# EAGLE design Naze32 (EAGLE 7.1.0)
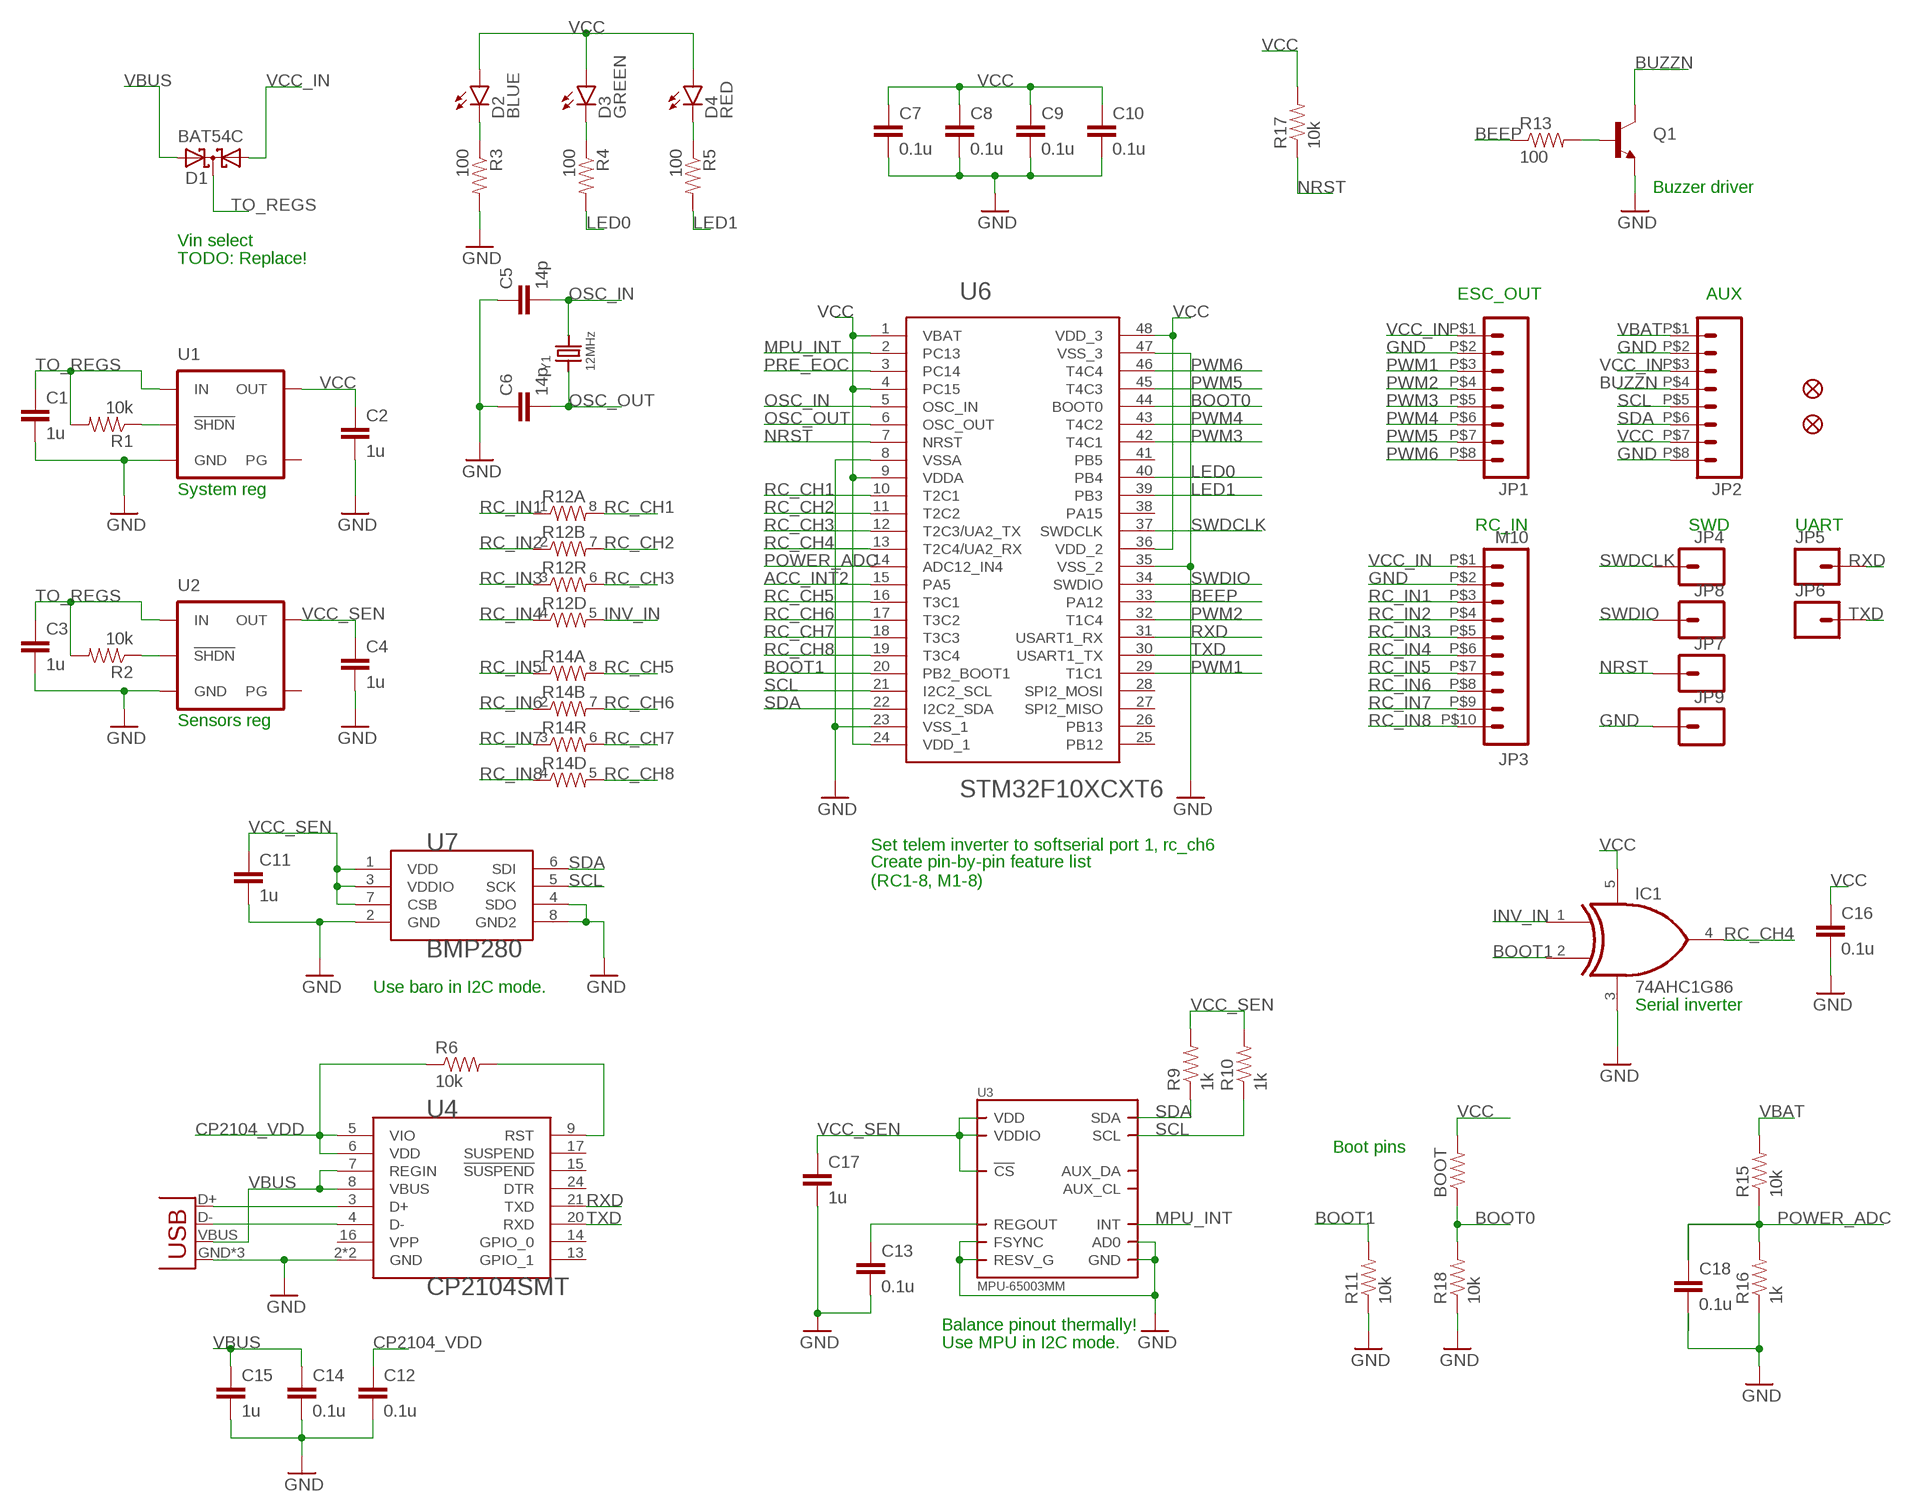
[diagram p0: schematic, sheet 1]

## Parts
BOOT  RESISTOR0603  [0603-RES]
C1  1u  CAP0402-CAP  [0402-CAP]
C2  1u  CAP0402-CAP  [0402-CAP]
C3  1u  CAP0402-CAP  [0402-CAP]
C4  1u  CAP0402-CAP  [0402-CAP]
C5  14p  CAP0402-CAP  [0402-CAP]
C6  14p  CAP0402-CAP  [0402-CAP]
C7  0.1u  CAP0402-CAP  [0402-CAP]
C8  0.1u  CAP0402-CAP  [0402-CAP]
C9  0.1u  CAP0402-CAP  [0402-CAP]
C10  0.1u  CAP0402-CAP  [0402-CAP]
C11  1u  CAP0402-CAP  [0402-CAP]
C12  0.1u  CAP0402-CAP  [0402-CAP]
C13  0.1u  CAP0402-CAP  [0402-CAP]
C14  0.1u  CAP0402-CAP  [0402-CAP]
C15  1u  CAP0402-CAP  [0402-CAP]
C16  0.1u  CAP0402-CAP  [0402-CAP]
C17  1u  CAP0402-CAP  [0402-CAP]
C18  0.1u  CAP0402-CAP  [0402-CAP]
D1  BAT54C  [SOT23]
D2  BLUE  LED-BLUE0603  [LED-0603]
D3  GREEN  LED-GREEN0603  [LED-0603]
D4  RED  LED-RED0603  [LED-0603]
FID1  FIDUCIALUFIDUCIAL  [MICRO-FIDUCIAL]
FID2  FIDUCIALUFIDUCIAL  [MICRO-FIDUCIAL]
IC1  74AHC1G86  74AHC1G86DCK  [SC70-5]
J1  USB-MICROB  [USB-MICROB]
JP1  M08PAD-1X8  [PAD-1X8]
JP2  M08PAD-1X8  [PAD-1X8]
JP3  M10  [PAD_1X10]
JP4  SCK  M01ROUND  [PAD-ROUND]
JP5  RX  M01ROUND  [PAD-ROUND]
JP6  TX  M01ROUND  [PAD-ROUND]
JP7  RST  M01ROUND  [PAD-ROUND]
JP8  IO  M01ROUND  [PAD-ROUND]
JP9  GND  M01ROUND  [PAD-ROUND]
Q1  TRANSISTOR_NPNSOT23  [SOT23]
R1  10k  RESISTOR  [0402-RES]
R2  10k  RESISTOR  [0402-RES]
R3  100  RESISTOR  [0402-RES]
R4  100  RESISTOR  [0402-RES]
R5  100  RESISTOR  [0402-RES]
R6  10k  RESISTOR  [0402-RES]
R9  1k  RESISTOR  [0402-RES]
R10  1k  RESISTOR  [0402-RES]
R11  10k  RESISTOR  [0402-RES]
R12  RESISTOR-ARRAY0603-ARV  [0603-ARV]
R13  100  RESISTOR  [0402-RES]
R14  RESISTOR-ARRAY0603-ARV  [0603-ARV]
R15  10k  RESISTOR  [0402-RES]
R16  1k  RESISTOR  [0402-RES]
R17  10k  RESISTOR  [0402-RES]
R18  10k  RESISTOR  [0402-RES]
U1  MCP18243.3V  [SOT23-5]
U2  MCP18243.3V  [SOT23-5]
U3  MPU-65003MM  [QFN-24_3X3]
U4  CP2104SMT  [QFN-24_ALT2]
U6  STM32F10XCXT6  [TQFP48]
U7  BMP280  [LGA8]
Y1  12MHz  CRYSTAL.3.2X2.5MM  [3.2X2.5MM]

## Nets
ACC_INT2: U6.15(PA5)
BEEP: R13.1 U6.33(PA12)
BOOT0: BOOT.1 R18.2 U6.44(BOOT0)
BOOT1: IC1.2(I1) R11.2 U6.20(PB2_BOOT1)
BUZZN: JP2.P$4 Q1.3(C)
CP2104_VDD: C12.1 R6.1 U4.5(VIO) U4.6(VDD)
GND: C1.2 C2.2 C3.2 C4.2 C5.1 C6.1 C7.2 C8.2 C9.2 C10.2 C11.2 C12.2 C13.2 C14.2 C15.2 C16.2 C17.2 C18.2 IC1.3(GND) J1.GND J1.MT1(GND) J1.MT2(GND) JP1.P$2 JP2.P$2 JP2.P$8 JP3.P$2 JP9.P$1 Q1.2(E) R3.2 R11.1 R16.1 R18.1 U1.2(GND) U2.2(GND) U3.9(AD0) U3.11(FSYNC) U3.18(GND) U3.20(RESV_G) U4.2(GND) U4.EP(GND) U6.8(VSSA) U6.23(VSS_1) U6.35(VSS_2) U6.47(VSS_3) U7.2(GND) U7.4(SDO) U7.8(GND2)
INV_IN: IC1.1(I0) R12.5
LED0: R4.2 U6.40(PB4)
LED1: R5.2 U6.39(PB3)
MPU_INT: U3.12(INT) U6.2(PC13)
N$1: J1.D+ U4.3(D+)
N$2: R2.1 U2.3(!SHDN)
N$3: R1.1 U1.3(!SHDN)
N$4: D2.C R3.1
N$5: J1.D- U4.4(D-)
N$7: D3.C R4.1
N$8: D4.C R5.1
N$9: R6.2 U4.9(RST)
N$15: C13.1 U3.10(REGOUT)
N$17: Q1.1(B) R13.2
NRST: JP7.P$1 R17.1 U6.7(NRST)
OSC_IN: C5.2 U6.5(OSC_IN) Y1.3
OSC_OUT: C6.2 U6.6(OSC_OUT) Y1.1
POWER_ADC: C18.1 R15.1 R16.2 U6.14(ADC12_IN4)
PRE_EOC: U6.3(PC14)
PWM1: JP1.P$3 U6.29(T1C1)
PWM2: JP1.P$4 U6.32(T1C4)
PWM3: JP1.P$5 U6.42(T4C1)
PWM4: JP1.P$6 U6.43(T4C2)
PWM5: JP1.P$7 U6.45(T4C3)
PWM6: JP1.P$8 U6.46(T4C4)
RC_CH1: R12.8 U6.10(T2C1)
RC_CH2: R12.7 U6.11(T2C2)
RC_CH3: R12.6 U6.12(T2C3/UA2_TX)
RC_CH4: IC1.4(O) U6.13(T2C4/UA2_RX)
RC_CH5: R14.8 U6.16(T3C1)
RC_CH6: R14.7 U6.17(T3C2)
RC_CH7: R14.6 U6.18(T3C3)
RC_CH8: R14.5 U6.19(T3C4)
RC_IN1: JP3.P$3 R12.1
RC_IN2: JP3.P$4 R12.2
RC_IN3: JP3.P$5 R12.3
RC_IN4: JP3.P$6 R12.4
RC_IN5: JP3.P$7 R14.1
RC_IN6: JP3.P$8 R14.2
RC_IN7: JP3.P$9 R14.3
RC_IN8: JP3.P$10 R14.4
RXD: JP5.P$1 U4.21(TXD) U6.31(USART1_RX)
SCL: JP2.P$5 R10.1 U3.23(SCL) U6.21(I2C2_SCL) U7.5(SCK)
SDA: JP2.P$6 R9.1 U3.24(SDA) U6.22(I2C2_SDA) U7.6(SDI)
SWDCLK: JP4.P$1 U6.37(SWDCLK)
SWDIO: JP8.P$1 U6.34(SWDIO)
TO_REGS: C1.1 C3.1 D1.3(CC) R1.2 R2.2 U1.1(IN) U2.1(IN)
TXD: JP6.P$1 U4.20(RXD) U6.30(USART1_TX)
VBAT: JP2.P$1 R15.2
VBUS: C14.1 C15.1 D1.2(A2) J1.VBUS U4.7(REGIN) U4.8(VBUS)
VCC: BOOT.2 C2.1 C7.1 C8.1 C9.1 C10.1 C16.1 D2.A D3.A D4.A IC1.5(VCC) JP2.P$7 R17.2 U1.5(OUT) U6.1(VBAT) U6.4(PC15) U6.9(VDDA) U6.24(VDD_1) U6.36(VDD_2) U6.48(VDD_3)
VCC_IN: D1.1(A1) JP1.P$1 JP2.P$3 JP3.P$1
VCC_SEN: C4.1 C11.1 C17.1 R9.2 R10.2 U2.5(OUT) U3.8(VDDIO) U3.13(VDD) U3.22(!CS) U7.1(VDD) U7.3(VDDIO) U7.7(CSB)
Unconnected: U1.4(PG) U2.4(PG) U3.7(AUX_CL) U3.21(AUX_DA) U4.13(GPIO_1) U4.14(GPIO_0) U4.15(!SUSPEND) U4.16(VPP) U4.17(SUSPEND) U4.24(DTR) U6.25(PB12) U6.26(PB13) U6.27(SPI2_MISO) U6.28(SPI2_MOSI) U6.38(PA15) U6.41(PB5)

## Notes on the sheet
- Buzzer driver
- Vin select
- TODO: Replace!
- ESC_OUT | AUX
- System reg
- RC_IN | SWD | UART
- Sensors reg
- Set telem inverter to softserial port 1, rc_ch6
- Create pin-by-pin feature list
  (RC1-8, M1-8)
- Use baro in I2C mode.
- Serial inverter
- Boot pins
- Balance pinout thermally!
- Use MPU in I2C mode.

## Library data of the parts
BOOT R1-R6 R9-R11 R13 R15-R18 = Naze32Lib:RESISTOR: Resistor Basic schematic elements and footprints for 0603, 1206, and PTH resistors.
C1-C18 = Naze32Lib:CAP: Capacitor Standard 0603 ceramic capacitor, and 0.1" leaded capacitor.
D1 = Naze32Lib:BAT54C: Schottky Diodes Source: Fairchild .. BAT54.pdf
D2 = Naze32Lib:LED-BLUE: Blue LEDs for production use Various blue LEDs stocked by SparkFun production 0603 - DIO-08575 Rebel - DIO-09553 1206 - DIO-09911; PROD_ID: DIO-08575
D3 = Naze32Lib:LED-GREEN: Various green LEDs Green LEDs used in SFE Production 0603- DIO-00821 LARGE- DIO-00862 LILYPAD- DIO-09910; PROD_ID: DIO-00821
D4 = Naze32Lib:LED-RED: Assorted Red LEDs LilyPad 1206- DIO-09912 1206- DIO-00809 0603- DIO-00819; PROD_ID: DIO-00819
FID1 FID2 = Naze32Lib:FIDUCIAL: Fiducial Alignment Points Various fiducial points for machine vision alignment.
IC1 = Naze32Lib:74*1G86: 2-input EXCLUSIV-OR gate
J1 = Naze32Lib:USB: USB Connectors USB-B-PTH is fully proven SKU : PRT-00139/CONN-08278 USB-miniB is fully proven SKU : PRT-00587 USB-A-PCB is untested. USB-A-H is throughly reviewed, but untested. Spark Fun Electronics SKU : PRT-00437 USB-B-SMT is throughly reviewed, but untested. Needs silkscreen touching up. USB-A-S has not been used/tested USB-MB-H has not been used/tested USB-MICROB has been used. CONN-09505; PROD_ID: CONN-09505
JP1 JP2 = Naze32Lib:M08: Header 8 Standard 8-pin 0.1" header. Use with straight break away headers (SKU : PRT-00116), right angle break away headers (PRT-00553), swiss pins (PRT-00743), machine pins (PRT-00117), and female headers (PRT-00115).
JP3 = Naze32Lib:M10: Header 10 Standard 10-pin 0.1" header. Use with straight break away headers (SKU : PRT-00116), right angle break away headers (PRT-00553), swiss pins (PRT-00743), machine pins (PRT-00117), and female headers (PRT-00115).
JP4-JP9 = Naze32Lib:M01: Header 1 Standard 1-pin 0.1" header. Use with straight break away headers (SKU : PRT-00116), right angle break away headers (PRT-00553), swiss pins (PRT-00743), machine pins (PRT-00117), and female headers (PRT-00115).
Q1 = Naze32Lib:TRANSISTOR_NPN: Generic NPN BJT MMBT2222A - TRANS-08049 (SOT-23, 1A 40V) MPSA42 - TRANS-09116 (SOT-23, 500mA 300V) MMBT5088LT1G - TRANS-11160 (SOT-23, 50 mA 30V) BC547 - COM-08928 <http://www.sparkfun.com/products/8928> (TO-92 45V 100mA) (1.Collector 2.Base 3.Emitter) 2N3904 - COM-00521 <http://www.sparkfun.com/products/521> (TO-92 40V 200mA) (1.Emitter 2.Base 3.Collector) P2N2222A - COM-12852 <http://www.sparkfun.com/products/12852> (TO-92 40V 600mA) (1.Collector 2.Base 3.Emitter)
R12 R14 = Naze32Lib:RESISTOR-ARRAY: Array Chip Resistor Source: RS Component / Phycomp
U1 U2 = Naze32Lib:MCP1824: MIC5205 150mA vreg 3.3V - VREG-00822 5V - VREG-00823; PROD_ID: VREG-00822
U3 = Naze32Lib:MPU-6500
U4 = Naze32Lib:CP2104
U6 = Naze32Lib:STM32F10XCXT6: ST STM32F101/103 48pin LQFP
U7 = Naze32Lib:BMP280
Y1 = Naze32Lib:CRYSTAL

## Board
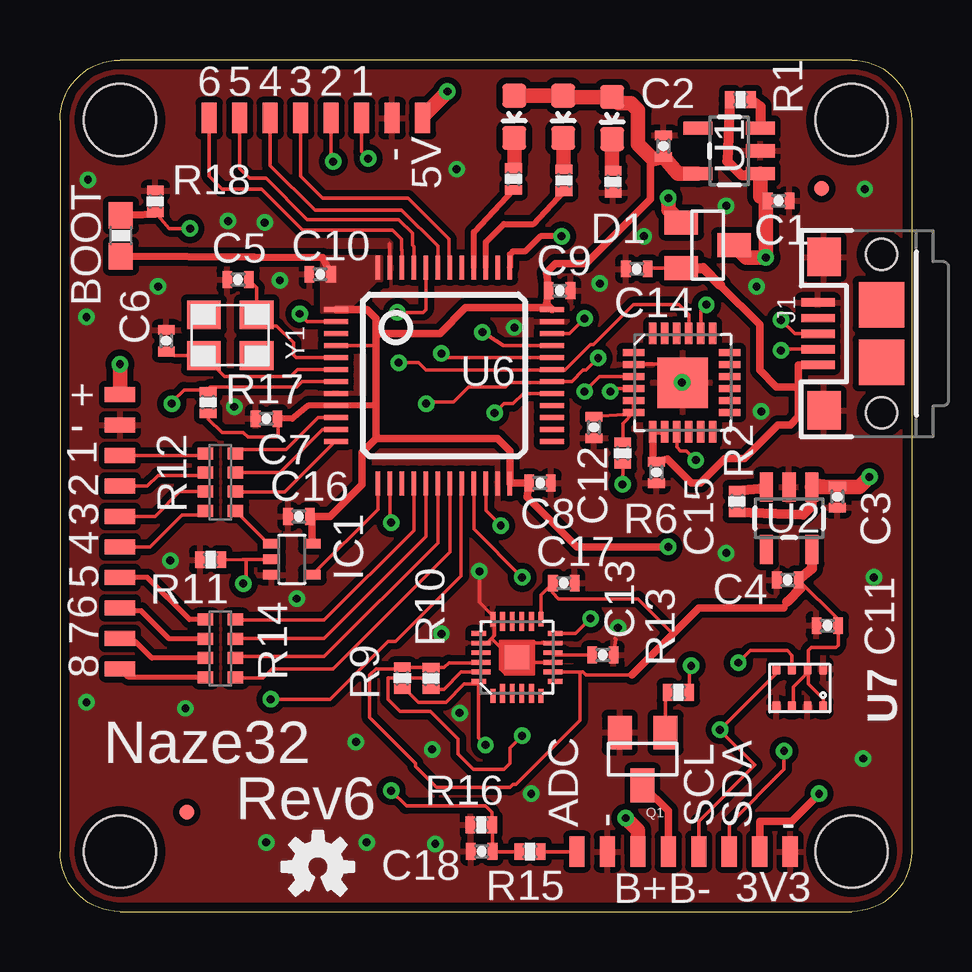
[diagram p1: board, top side]
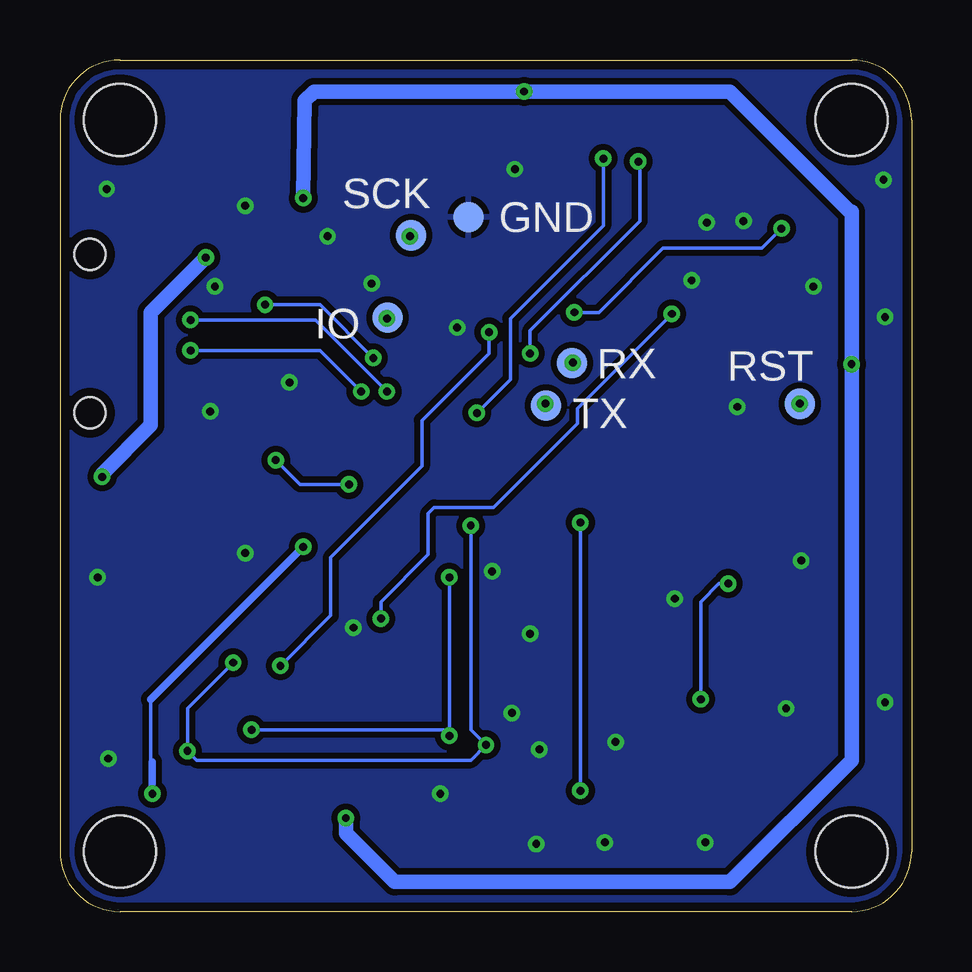
[diagram p2: board, bottom side, seen from below]

Size 35.5 x 35.5 mm. Coordinates in mm from the lower left corner, seen from the top.
Outline: 2.5,0 33,0 arc90 35.5,2.5 35.5,33 arc90 33,35.5 2.5,35.5 arc90 0,33 0,2.5 arc90 2.5,0
Copper layers (1*16): Top 0.0356mm / dielectric 1.5011mm / Bottom 0.0356mm
Design rules "OSHPark": minimum track width 6mil, minimum drill 13mil, track to track 6mil, track to pad 6mil, pad to pad 6mil, via to via 6mil, smd to smd 6mil, copper to edge 15mil, drill to drill 6mil, minimum pad ring 7mil, minimum via ring 7mil, stop-mask expansion 3mil, vias tented up to drill 0mil, thermal gap 10mil
Holes 3 mm at 2.5,2.5 33,2.5 33,33 2.5,33

### Footprints (pad centres in the part's own frame; a part is rotated, then mirrored left to right if it is on the bottom)
0603-RES = smd 1.1 x 1: 1 -0.85,0; 2 0.85,0
0402-CAP = smd 0.4 x 0.7: 1 -0.45,0; 2 0.45,0
SOT23 = smd 1 x 1.4: 1 -0.95,-1.1; 2 0.95,-1.1; 3 0,1.1
LED-0603 = smd 1 x 1: A 0,-0.877; C 0,0.877
MICRO-FIDUCIAL = smd 0.635 x 0.635: 1 0,0
SC70-5 = smd 0.4 x 0.7: 1 -0.65,-0.85; 2 0,-0.85; 3 0.65,-0.85; 4 0.65,0.85; 5 -0.65,0.85
USB-MICROB = smd 0.35 x 1.4: D+ 0,2.65; D- -0.65,2.65; GND 1.3,2.65; ID 0.65,2.65; VBUS -1.3,2.65 | smd 1.6 x 1.4: MT1 -3.2,2.4; MT2 3.2,2.4 | smd 1.9 x 1.9: P$1 -1.2,0; P$2 1.2,0 | hole 1.3: -3.3,0; 3.3,0
PAD-1X8 = smd 1.27 x 0.635: P$1 0,0; P$2 0,-1.27; P$3 0,-2.54; P$4 0,-3.81; P$5 0,-5.08; P$6 0,-6.35; P$7 0,-7.62; P$8 0,-8.89
PAD_1X10 = smd 1.27 x 0.635: P$1 0,0; P$2 0,-1.27; P$3 0,-2.54; P$4 0,-3.81; P$5 0,-5.08; P$6 0,-6.35; P$7 0,-7.62; P$8 0,-8.89; P$9 0,-10.16; P$10 0,-11.43
PAD-ROUND = smd 1.27 x 1.27: P$1 0,0
0402-RES = smd 0.4 x 0.7: 1 -0.45,0; 2 0.45,0
0603-ARV = smd 0.5 x 0.65: 1 -1.2,-0.625; 2 -0.4,-0.625; 3 0.4,-0.625; 4 1.2,-0.625; 5 1.2,0.625; 6 0.4,0.625; 7 -0.4,0.625; 8 -1.2,0.625
SOT23-5 = smd 0.55 x 1.2: 1 -0.95,-1.3; 2 0,-1.3; 3 0.95,-1.3; 4 0.95,1.3; 5 -0.95,1.3
QFN-24_3X3 = smd 0.6 x 0.2: 1 -1.6,1; 6 -1.6,-1; 13 1.6,-1; 18 1.6,1 | smd 0.8 x 0.2: 2 -1.5,0.6; 3 -1.5,0.2; 4 -1.5,-0.2; 5 -1.5,-0.6; 14 1.5,-0.6; 15 1.5,-0.2; 16 1.5,0.2; 17 1.5,0.6 | smd 0.2 x 0.6: 7 -1,-1.6; 12 1,-1.6; 19 1,1.6; 24 -1,1.6 | smd 0.2 x 0.8: 8 -0.6,-1.5; 9 -0.2,-1.5; 10 0.2,-1.5; 11 0.6,-1.5; 20 0.6,1.5; 21 0.2,1.5; 22 -0.2,1.5; 23 -0.6,1.5 | smd 1 x 1: EP 0,0
QFN-24_ALT2 = smd 0.9 x 0.3: 1 -2.05,1.25; 2 -2.05,0.75; 3 -2.05,0.25; 4 -2.05,-0.25; 5 -2.05,-0.75; 6 -2.05,-1.25; 13 1.95,-1.25; 14 1.95,-0.75; 15 1.95,-0.25; 16 1.95,0.25; 17 1.95,0.75; 18 1.95,1.25 | smd 0.3 x 0.9: 7 -1.25,-2.05; 8 -0.75,-2.05; 9 -0.25,-2.05; 10 0.25,-2.05; 11 0.75,-2.05; 12 1.25,-2.05; 19 1.25,2.05; 20 0.75,2.05; 21 0.25,2.05; 22 -0.25,2.05; 23 -0.75,2.05; 24 -1.25,2.05 | smd 2.1 x 2.1: EP 0,0
TQFP48 = smd 0.2 x 1: 1 -2.75,-4.5; 2 -2.25,-4.5; 3 -1.75,-4.5; 4 -1.25,-4.5; 5 -0.75,-4.5; 6 -0.25,-4.5; 7 0.25,-4.5; 8 0.75,-4.5; 9 1.25,-4.5; 10 1.75,-4.5; 11 2.25,-4.5; 12 2.75,-4.5; 25 2.75,4.5; 26 2.25,4.5; 27 1.75,4.5; 28 1.25,4.5; 29 0.75,4.5; 30 0.25,4.5; 31 -0.25,4.5; 32 -0.75,4.5; 33 -1.25,4.5; 34 -1.75,4.5; 35 -2.25,4.5; 36 -2.75,4.5 | smd 1 x 0.2: 13 4.5,-2.75; 14 4.5,-2.25; 15 4.5,-1.75; 16 4.5,-1.25; 17 4.5,-0.75; 18 4.5,-0.25; 19 4.5,0.25; 20 4.5,0.75; 21 4.5,1.25; 22 4.5,1.75; 23 4.5,2.25; 24 4.5,2.75; 37 -4.5,2.75; 38 -4.5,2.25; 39 -4.5,1.75; 40 -4.5,1.25; 41 -4.5,0.75; 42 -4.5,0.25; 43 -4.5,-0.25; 44 -4.5,-0.75; 45 -4.5,-1.25; 46 -4.5,-1.75; 47 -4.5,-2.25; 48 -4.5,-2.75
LGA8 = smd 0.5 x 0.35: 1 0.8,0.975; 2 0.8,0.325; 3 0.8,-0.325; 4 0.8,-0.975; 5 -0.8,-0.975; 6 -0.8,-0.325; 7 -0.8,0.325; 8 -0.8,0.975
3.2X2.5MM = smd 1.4 x 1.2: 1 -1.1,-0.85; 2 1.1,-0.85; 3 1.1,0.85; 4 -1.1,0.85

### Placement (x,y rotation side)
BOOT  2.54,28.17 270 top
C1  29.96,29.63 0 top
C2  25.16,31.91 90 top
C3  32.41,17.29 270 top
C4  30.34,13.83 180 top
C5  7.42,26.35 0 top
C6  4.44,23.79 270 top
C7  8.61,20.54 180 top
C8  20.02,17.87 0 top
C9  20.83,25.88 0 top
C10  10.85,26.56 180 top
C11  31.99,11.92 180 top
C12  22.26,20.18 270 top
C13  22.63,10.7 0 top
C14  24.05,26.79 180 top
C15  24.86,18.31 270 top
C16  9.96,16.47 180 top
C17  21,13.69 0 top
C18  17.58,2.51 180 top
D1  27,27.78 270 top
D2  23.02,33.08 180 top
D3  18.94,33.13 180 top
D4  20.98,33.13 180 top
FID1  5.29,4.14 0 top
FID2  31.75,30.14 0 top
IC1  9.67,14.69 270 top
J1  34.25,24.09 90 top
JP1  15.11,33.08 270 top
JP2  21.55,2.5 90 top
JP3  2.5,21.55 0 top
JP4  20.86,28.19 270 bottom
JP5  14.15,22.87 90 bottom
JP6  15.25,21.1 270 bottom
JP7  4.66,21.17 180 bottom
JP8  21.84,24.76 180 bottom
JP9  18.47,28.95 0 bottom
Q1  24.29,6.36 180 top
R1  28.37,33.85 180 top
R2  28.23,17.1 270 top
R3  23.06,30.42 270 top
R4  18.91,30.54 270 top
R5  21.01,30.48 270 top
R6  23.46,19.11 270 top
R9  14.27,9.73 90 top
R10  15.47,9.72 90 top
R11  6.29,14.67 0 top
R12  6.69,17.9 270 top
R13  25.78,9.14 180 top
R14  6.69,10.97 270 top
R15  19.59,2.5 0 top
R16  17.56,3.61 0 top
R17  6.18,21.23 270 top
R18  3.98,29.61 270 top
U1  27.9,31.71 90 top
U2  30.39,16.4 180 top
U3  19.05,10.59 90 top
U4  25.96,22.05 0 top
U6  16,22.35 270 top
U7  30.84,9.32 270 top
U$1  [OSHW-LOGO-S]  10.76,1.86 0 top
Y1  7.1,24.03 0 top

### Tracks (layer width: path | path; a pad name or v marks a point on that pad's centre or on a via)
BEEP  (via drill 0.33)
  Top 0.152: U6.33 18.48,23.6 v17.61,24.15 | v26.31,10.25 26.33,10.23 26.23,10.13 R13.1
  Bottom 0.152: v17.61,24.15 17.61,23.27 20.41,20.47 20.41,18.57 24.22,14.76 24.22,12.34 v26.31,10.25
BOOT0  (via drill 0.33)
  Top 0.152: 3.96,29.07 R18.2 4.56,28.47 v5.42,28.47 | U6.44 15.25,25.09 15.14,24.98 v14.06,24.98
  Top 0.305: BOOT.1 3.96,29.07
  Bottom 0.152: v5.42,28.47 6.25,27.65 10.37,27.65 13.04,24.98 v14.06,24.98
BOOT1  (via drill 0.33)
  Top 0.152: IC1.2 7.77,14.69 | 7.77,14.69 7.62,14.69 R11.2 | U6.20 16.72,17.82 16.72,13.99 13.99,11.26 13.68,11.26 11.26,8.85 v8.79,8.85 | v7.64,13.68 7.77,13.8 7.77,14.69
  Bottom 0.152: v8.79,8.85 8.79,12.91 8.02,13.68 v7.64,13.68
BUZZN
  Top 0.305: JP2.P$4 25.36,4.19 Q1.3
CP2104_VDD
  Top 0.152: C12.1 23.84,20.73 U4.6 | U4.6 23.46,20.35 R6.1 | U4.5 U4.6
GND  (via drill 0.33)
  Top 0.152: U4.2 23.93,22.82 25.36,22.82 25.93,22.25 v25.93,22.06 | 23.14,11.39 23.18,11.35 C13.2 | U6.47 13.74,27.84 | 17.99,11.39 18.12,11.52 18.12,12.12 U3.18 18.05,12.31 17.49,12.88 v17.49,14.18 | 17.99,11.39 17.79,11.19 U3.20 | U3.9 19.25,10.39 19.01,10.63 | 19.01,10.63 18.76,10.63 17.99,11.39 | U3.11 19.45,11.19 19.26,11.01 19.26,10.88 19.01,10.63
  other vias: 8.6,2.88 5.23,8.47 4.6,14.63 9.87,13.04 4.09,26.06 1.17,30.5 33.55,30.12 33.93,13.93 27.77,14.95 33.49,6.37 19.64,4.91 15.52,6.75 9.17,26.31 7.26,21.04 8.53,28.73 18.95,24.34 24.34,28.15 22.5,26.19 29.04,26.06 12.79,2.88 1.1,8.72 1.1,24.79 7.01,28.79 16.53,30.95 27.77,29.42 29.23,20.85 12.34,7.07 16.66,8.28 15.9,11.58 15.64,2.82 23.26,11.83
  pour Top (isolate 0.254, rank 2): -1.31,36.79 -1.31,-1.31 36.79,-1.31 36.79,36.79
  pour Bottom (isolate 0.254): 36.79,36.79 36.79,-1.31 -1.31,-1.31 -1.31,36.79
INV_IN
  Top 0.152: R12.5 8.68,15.34 IC1.1
LED0
  Top 0.254: U6.40 17.25,28.33 R4.2
LED1
  Top 0.254: U6.39 17.75,27.91 18.5,28.66 19.74,28.66 R5.2
MPU_INT  (via drill 0.33)
  Top 0.152: U6.2 10.31,24.6 v9.99,24.92 | v22.12,12.22 21.5,11.59 U3.12
  Bottom 0.152: v22.12,12.22 22.12,12.91 20.15,14.88 20.15,16.6 19.9,16.85 17.42,16.85 13.93,20.34 13.93,20.98 v9.99,24.92
N$1  (via drill 0.33)
  Top 0.152: J1.D+ 30.63,24.09 v30.06,24.66 | U4.3 22.49,22.3 v21.87,21.68
  Bottom 0.152: v30.06,24.66 24.85,24.66 v21.87,21.68
N$2
  Top 0.406: R2.1 29.39,17.65 U2.3
N$3
  Top 0.406: R1.1 29.2,33.57 U1.3
N$4
  Top 0.406: 23.02,31.01 R3.1
  Top 0.61: D2.C 23.02,31.01
N$5  (via drill 0.33)
  Top 0.152: J1.D- 30.11,23.44 v30.06,23.39 | U4.4 23.07,21.8 v22.95,21.68
  Bottom 0.152: v30.06,23.39 24.66,23.39 v22.95,21.68
N$7
  Top 0.406: 18.94,31.12 R4.1
  Top 0.61: D3.C 18.94,31.12
N$8
  Top 0.406: 20.98,31.06 R5.1
  Top 0.61: D4.C 20.98,31.06
N$9  (via drill 0.33)
  Top 0.152: U4.9 25.71,19.36 25.87,19.2 26.12,19.2 v26.5,18.82 | R6.2 23.46,17.87 v23.45,17.8
  Bottom 0.152: v23.45,17.8 25.49,17.8 v26.5,18.82
N$15
  Top 0.152: U3.10 20.64,10.7 C13.1
N$17
  Top 0.152: Q1.1 25.24,8.81 R13.2
NRST  (via drill 0.33)
  Top 0.152: U6.7 10.1,22.1 9.87,21.87 6.27,21.87 R17.1 6.14,21.74 5.17,21.74 4.66,21.23 JP7.P$1
  Bottom 0.152: JP7.P$1
  other vias: 4.66,21.17
OSC_IN
  Top 0.152: C5.2 8.2,26 Y1.3 8.67,24.41 9.04,24.41 9.74,23.71 9.74,23.2 9.84,23.1 U6.5
OSC_OUT
  Top 0.152: U6.6 9.9,22.6 9.61,22.31 6.87,22.31 Y1.1 4.75,23.18 C6.2
POWER_ADC  (via drill 0.33)
  Top 0.152: R15.1 18.14,2.5 C18.1 18.03,3.59 R16.2 | 18.13,3.59 R16.2 | U6.14 13.75,16.27 v13.8,16.22 | R16.2 18.01,4.13 17.74,4.41 14.44,4.41 v13.8,5.04
  Bottom 0.152: v13.8,5.04 v13.8,16.22
PWM1  (via drill 0.33)
  Top 0.152: U6.29 19.31,21.6 18.88,21.17 18.5,21.17 v18.12,20.79 | JP1.P$3 12.57,31.67 v12.85,31.39
  Bottom 0.152: v12.85,31.39 12.85,28.6 16.72,24.73 16.72,22.18 v18.12,20.79
PWM2  (via drill 0.33)
  Top 0.152: JP1.P$4 11.3,31.36 v11.39,31.27 | U6.32 16.06,23.1 v15.9,23.27
  Bottom 0.152: v15.9,23.27 15.9,24.22 11.33,28.79 11.33,31.2 v11.39,31.27
PWM3
  Top 0.152: 9.99,33.04 JP1.P$5 10.03,30.66 10.95,29.74 14.5,29.74 16.22,28.03 16.22,26.88 U6.42
PWM4
  Top 0.152: U6.43 15.75,27.73 14.25,29.23 10.63,29.23 8.76,31.1 JP1.P$6 8.72,33.04
PWM5
  Top 0.152: U6.45 14.75,27.71 14.69,27.77 14.69,28.28 14.12,28.85 10.31,28.85 8.6,30.57 7.9,30.57 7.49,30.97 JP1.P$7
PWM6
  Top 0.152: U6.46 14.25,27.58 14.25,28.03 13.87,28.41 10.12,28.41 8.41,30.12 6.75,30.12 6.22,30.66 JP1.P$8 6.31,32.99
RC_CH1
  Top 0.152: U6.10 10.76,20.6 9.42,19.26 7.48,19.26 R12.8
RC_CH2
  Top 0.152: U6.11 10.96,20.1 9.17,18.31 7.33,18.31 R12.7
RC_CH3
  Top 0.152: U6.12 11.47,19.6 9.36,17.49 7.33,17.49 R12.6
RC_CH4
  Top 0.152: U6.13 13.25,16.77 IC1.4
RC_CH5
  Top 0.152: U6.16 14.75,15.89 11.01,12.15 7.33,12.15 R14.8
RC_CH6
  Top 0.152: U6.17 15.25,15.63 11.01,11.39 7.33,11.39 R14.7
RC_CH7
  Top 0.152: U6.18 15.75,15.37 11.01,10.63 7.37,10.63 R14.6
RC_CH8
  Top 0.152: U6.19 16.25,14.98 11.39,10.12 8.85,10.12 8.47,9.74 7.35,9.74 R14.5
RC_IN1
  Top 0.152: R12.1 5.97,19.01 JP3.P$3
RC_IN2
  Top 0.152: JP3.P$4 3.64,17.74 4.09,18.18 5.95,18.18 R12.2
RC_IN3
  Top 0.152: R12.3 4.99,17.5 3.96,16.47 JP3.P$5
RC_IN4
  Top 0.152: JP3.P$6 3.77,15.2 5.1,16.53 5.9,16.53 R12.4
RC_IN5
  Top 0.203: R14.1 5.4,12.17 3.64,13.93 JP3.P$7
RC_IN6
  Top 0.203: R14.2 4.55,11.37 3.39,12.53 2.63,12.53 JP3.P$8
RC_IN7
  Top 0.203: R14.3 3.83,10.57 3.13,11.26 2.63,11.26 JP3.P$9
RC_IN8
  Top 0.203: R14.4 2.85,9.77 JP3.P$10
RXD  (via drill 0.33)
  Top 0.152: v14.12,22.88 14.95,22.88 15.26,22.57 20.47,22.57 U6.31 20.53,22.57 21.04,22.57 22.12,23.64 22.25,23.64 23.9,25.3 25.8,25.3 26.21,24.89 U4.21
  Bottom 0.152: JP5.P$1 14.14,22.93 v14.12,22.88
SCL  (via drill 0.33)
  Top 0.152: JP2.P$5 26.63,3.77 28.96,6.11 27.52,7.55 v27.52,7.58 29.86,9.93 U7.5 | U6.21 17.25,15.94 v19.26,13.93 | U3.23 16.72,9.99 16,9.27 R10.1 15.47,9.34 15.07,9.74 13.68,9.74 13.68,8.85 14.18,8.34 15.45,8.34 16.6,7.2 16.6,6.56 17.23,5.93 18.5,5.93 18.76,6.18 18.76,6.82 v19.26,7.33
  Bottom 0.152: v19.26,13.93 v19.26,7.33 19.52,7.58 v27.52,7.58
SDA  (via drill 0.33)
  Top 0.152: JP2.P$6 27.9,3.64 30.19,5.93 v30.19,6.69 | U6.22 17.75,16.71 v18.38,16.09 | R9.1 14.39,9.28 14.95,8.72 16.09,8.72 16.85,9.48 17.34,9.48 U3.24 17.45,7.24 v17.74,6.95 | U7.6 30.52,10.68 30.31,10.88 28.79,10.88 v28.28,10.37
  Bottom 0.152: v18.38,16.09 18.38,7.58 v17.74,6.95 18.38,6.31 29.8,6.31 v30.19,6.69 30.19,8.47 v28.28,10.37
SWDCLK  (via drill 0.33)
  Top 0.254: v20.91,28.15 20.03,28.15 19.39,27.52 18.88,27.52 18.76,27.39 U6.37
  Bottom 0.152: JP4.P$1 20.89,28.15 v20.91,28.15
SWDIO  (via drill 0.33)
  Top 0.152: v21.87,24.73 21.24,24.1 U6.34
  Bottom 0.152: JP8.P$1 v21.87,24.73
TO_REGS  (via drill 0.33)
  Top 0.152: v29.42,27.27
  Top 0.406: R1.2 27.82,31.28 28.4,30.7 29.14,30.7 U1.1 | 29.2,29.81 C1.1 | C3.1 31.48,17.84 U2.1 31.34,17.69 31.34,16.9 30.98,16.55 R2.2
  Top 0.61: U1.1 29.2,29.81 | U2.1 33.32,17.7 v33.74,18.12 | D1.3 28.61,27.27 v29.42,27.27 29.42,29.43 C1.1
  Bottom 0.61: v29.42,27.27 31.71,24.98 31.71,20.28 33.74,18.25 v33.74,18.12
TXD  (via drill 0.33)
  Top 0.152: v15.26,21.17 15.33,21.23 16.41,21.23 17.04,21.87 18.57,21.87 18.76,22.06 20.46,22.06 U6.30 21.34,22.1 21.8,22.57 21.93,22.57 v22.44,23.07 | U4.20 26.71,25.06 v26.95,25.3
  Bottom 0.152: JP6.P$1 15.38,21.16 v15.26,21.17 | v22.44,23.07 24.66,25.3 v26.95,25.3
VBAT
  Top 0.152: JP2.P$1 R15.2
VBUS
  Top 0.152: J1.VBUS 30.95,22.79 | C15.1 24.71,19.02 | D1.2 24.63,26.83 C14.1
  Top 0.254: U4.8 U4.7
  Top 0.305: 24.71,19.02 U4.7 | C15.1 25.32,18.86 26.31,17.87 26.69,17.87 27.71,18.88 28.54,18.88 29.93,20.28 30.44,20.28 30.79,20.63 30.79,21.87 | 27.52,26.12 29.17,24.47 29.17,22.57 29.87,21.87 30.79,21.87 | 30.95,22.79 30.79,22.79 30.79,21.87
  Top 0.406: D1.2 26.81,26.83 27.52,26.12
VCC  (via drill 0.33)
  Top 0.152: 10.52,16.46 C16.1 | 11.46,25.14 U6.1 | U6.9 | 12.98,21.11 13.17,21.3 | C7.1 9.1,20.49 9.1,19.84 9.04,19.77 7.83,19.77 7.64,19.96 6.75,19.96 6.18,20.54 R17.2 | U6.4 13.02,23.6 13.17,23.45
  Top 0.254: U6.9 12.98,21.11 | U6.9 10.37,21.11 9.68,20.54 C7.1
  Top 0.305: IC1.5 10.52,16.46 11.26,16.46 12.6,17.8 12.6,19.14 13.17,19.71 | BOOT.2 10.96,27.27 C10.1 | 24.62,31.48 24.62,29.7 21.93,27.01 20.66,27.01 20.28,26.63 C9.1 20.28,25.32 U6.36 20.43,25.17 16.91,25.17 15.84,24.09 13.17,24.09 | 13.17,24.09 13.17,23.45 13.17,21.3 13.17,19.71 | 13.17,24.09 13.17,24.73 12.79,25.1 U6.1 | 13.17,19.71 18.25,19.71 18.76,19.2 U6.24 18.77,17.87 C8.1 19.46,17.28 21.55,15.2 v25.36,15.2 | v31.65,4.91 30.5,3.77 29.17,3.77 JP2.P$7
  Top 0.406: 23.28,33.7 D2.A | 21.03,33.96 D4.A
  Top 0.61: U1.5 25.76,30.76 C2.1 24.74,31.36 24.62,31.48 24.1,32 24.1,33.4 23.8,33.7 23.28,33.7 | D2.A 21.03,33.96 | D4.A D3.A
  Bottom 0.152: 31.65,6.25 31.71,6.31 31.71,8.85
  Bottom 0.305: v25.36,15.2 31.71,8.85 | 31.65,6.25 v31.65,4.91
  pour Top (no thermals): 13.3,27.3 10.9,27.3 10.9,25 12,25 12,25.1 13.2,26.3 13.4,26.3 13.4,27.3
VCC_IN  (via drill 0.33)
  Top 0.61: JP2.P$3 24.09,3.39 v23.58,3.9 | JP3.P$1 v2.5,22.82 | JP1.P$1 15.11,33.14 v16.15,34.19 | v25.36,29.74 25.36,29.27 D1.1
  Bottom 0.61: v23.58,3.9 23.58,3.26 21.55,1.23 7.58,1.23 2.5,6.31 v2.5,22.82 2.5,29.17 2.56,29.17 7.58,34.19 v16.15,34.19 24.92,34.19 25.3,33.8 25.36,29.8 v25.36,29.74
VCC_SEN
  Top 0.152: 15.46,10.28 R10.2 | 30.89,13.49 C4.1 32.44,12.17 C11.1 32.44,11.1 32.34,11.01 31.33,11.01 31.2,10.88 31.2,10.16 U7.7 | 30.31,12.91 30.31,12.79 30.19,12.66 | R10.2 R9.2 14.21,10.12 13.17,10.12 12.91,9.87 12.91,8.09 14.82,6.18 14.82,6.06 15.71,5.17 18.76,5.17 18.88,5.29 19.01,5.29 21.68,7.96 21.68,9.99 | R10.2 16.01,10.17 16.22,10.37 17.53,10.37 U3.22 | C17.1 20.05,13.19 U3.13 20.05,13.19 20.53,13.68 20.53,13.29 20.79,13.04 24.09,13.04 25.55,11.58 | 23.84,9.87 21.93,9.87 21.8,9.99 21.68,9.99 | U3.8 21.68,9.99 | U7.7 31.16,9.96 30.57,9.36 30.57,8.57 U7.3 | U7.1 31.82,8.87 31.2,9.48 31.2,10.08 U7.7
  Top 0.305: 23.84,9.87 25.55,11.58 26.63,12.66 30.19,12.66
  Top 0.406: U2.5 31.34,14.29 C4.1 | 30.89,13.49 30.31,12.91

### Text on the board
tPlace: 6 | 5 | 4 | 3 | 2 | 1 | - | 5V | + | - | 1 | 2 | 3 | 4 | 5 | 6 | 7 | 8 | Naze32 | Rev6 | ADC | - | SCL | SDA | - | B+ | B- | 3V3